# Altium schematic sheet ESP32.SchDoc
size A4; SheetNumber: 1; SheetTotal: 5
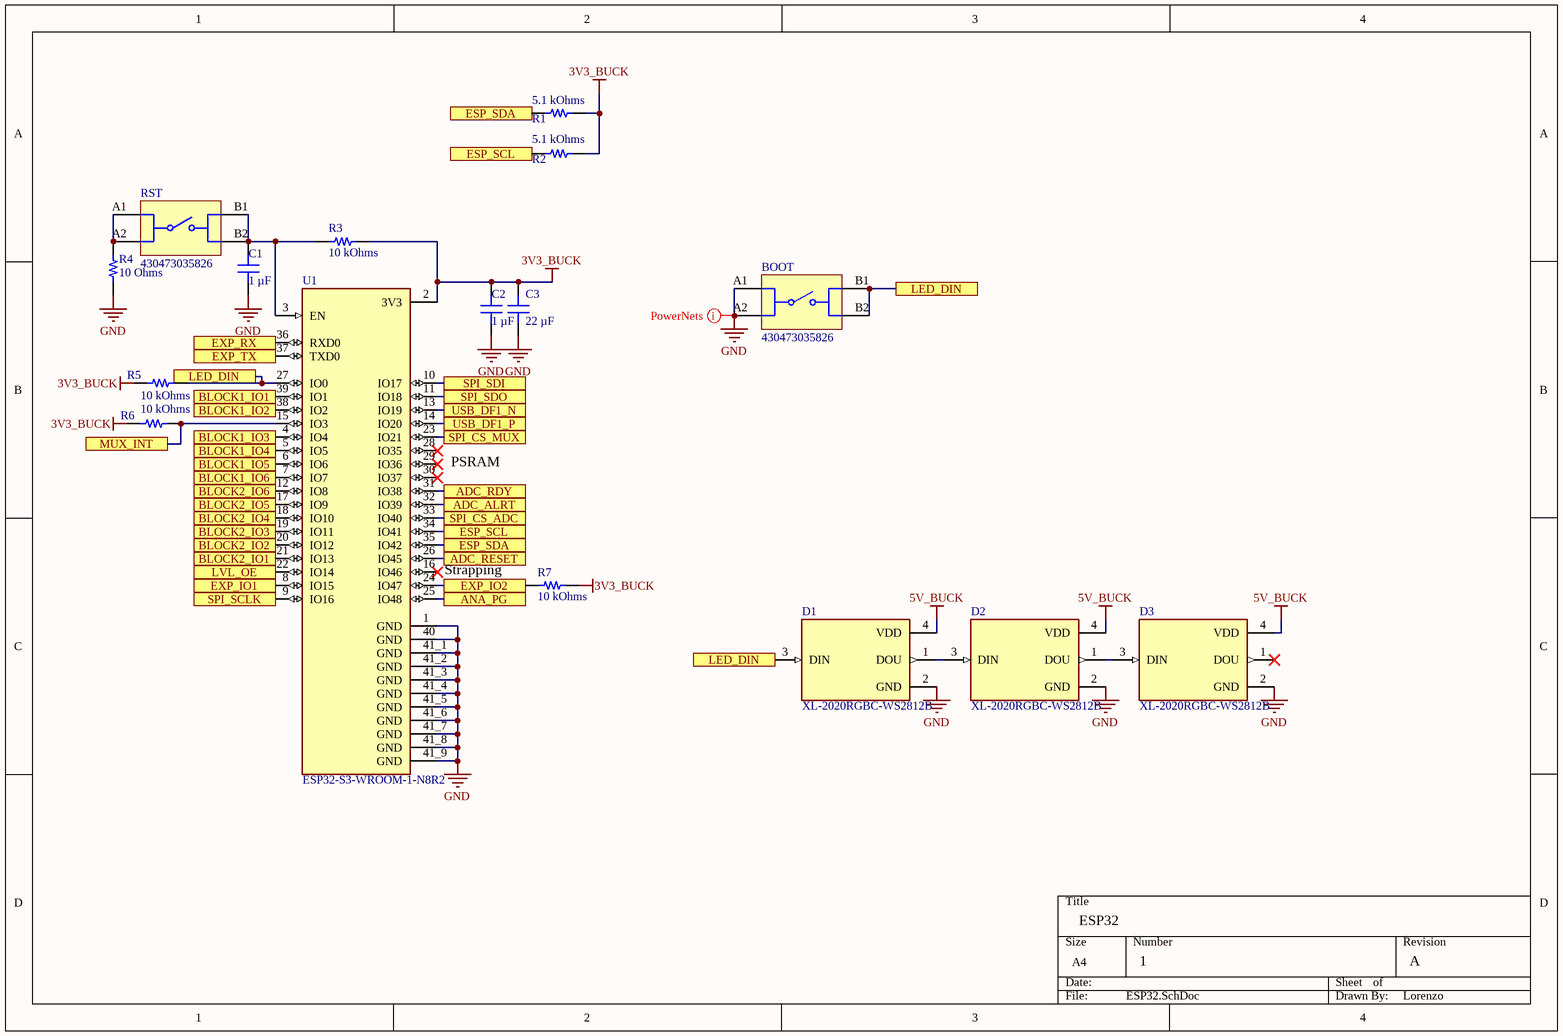
[diagram p0: ESP32.SchDoc]

## Parts
BOOT  430473035826  [430473035826]
C1  1 µF  [CAP 0603_1608]
C2  1 µF  [CAP 0603_1608]
C3  22 µF  [CAP 0603_1608]
D1  XL-2020RGBC-WS2812B  [LED_XL-2020RGBC-WS2812B]
D2  XL-2020RGBC-WS2812B  [LED_XL-2020RGBC-WS2812B]
D3  XL-2020RGBC-WS2812B  [LED_XL-2020RGBC-WS2812B]
R1  5.1 kOhms  [RES 0603_1608]
R2  5.1 kOhms  [RES 0603_1608]
R3  10 kOhms  [RES 0603_1608]
R4  10 Ohms  [RES 0603_1608]
R5  10 kOhms  [RES 0603_1608]
R6  10 kOhms  [RES 0603_1608]
R7  10 kOhms  [RES 0603_1608]
RST  430473035826  [430473035826]
U1  ESP32-S3-WROOM-1-N8R2  [XCVR_ESP32-S3-WROOM-1-N8R2]

## Ports
ADC_ALRT, ADC_RDY, ADC_RESET, ANA_PG, BLOCK1_IO1, BLOCK1_IO2, BLOCK1_IO3, BLOCK1_IO4, BLOCK1_IO5, BLOCK1_IO6, BLOCK2_IO1, BLOCK2_IO2, BLOCK2_IO3, BLOCK2_IO4, BLOCK2_IO5, BLOCK2_IO6, ESP_SCL, ESP_SDA, EXP_IO1, EXP_IO2, EXP_RX, EXP_TX, LED_DIN, LVL_OE, MUX_INT, SPI_CS_ADC, SPI_CS_MUX, SPI_SCLK, SPI_SDI, SPI_SDO, USB_DF1_N, USB_DF1_P

## Nets
3V3_BUCK: C2.2 C3.2 R1.2 R2.2 R3.2 R5.1 R6.1 R7.1 U1.2(3V3)
5V_BUCK: D1.4(VDD) D2.4(VDD) D3.4(VDD)
GND: BOOT.A1 BOOT.A2 C1.1 C2.1 C3.1 D1.2(GND) D2.2(GND) D3.2(GND) R4.1 U1.1(GND) U1.40(GND) U1.41_1(GND) U1.41_2(GND) U1.41_3(GND) U1.41_4(GND) U1.41_5(GND) U1.41_6(GND) U1.41_7(GND) U1.41_8(GND) U1.41_9(GND)
ADC_ALRT: U1.32(IO39) ; port ADC_ALRT
ADC_RDY: U1.31(IO38) ; port ADC_RDY
ADC_RESET: U1.26(IO45) ; port ADC_RESET
ANA_PG: U1.25(IO48) ; port ANA_PG
BLOCK1_IO1: U1.39(IO1) ; port BLOCK1_IO1
BLOCK1_IO2: U1.38(IO2) ; port BLOCK1_IO2
BLOCK1_IO3: U1.4(IO4) ; port BLOCK1_IO3
BLOCK1_IO4: U1.5(IO5) ; port BLOCK1_IO4
BLOCK1_IO5: U1.6(IO6) ; port BLOCK1_IO5
BLOCK1_IO6: U1.7(IO7) ; port BLOCK1_IO6
BLOCK2_IO1: U1.21(IO13) ; port BLOCK2_IO1
BLOCK2_IO2: U1.20(IO12) ; port BLOCK2_IO2
BLOCK2_IO3: U1.19(IO11) ; port BLOCK2_IO3
BLOCK2_IO4: U1.18(IO10) ; port BLOCK2_IO4
BLOCK2_IO5: U1.17(IO9) ; port BLOCK2_IO5
BLOCK2_IO6: U1.12(IO8) ; port BLOCK2_IO6
ESP_SCL: R2.1 U1.34(IO41) ; port ESP_SCL
ESP_SDA: R1.1 U1.35(IO42) ; port ESP_SDA
EXP_IO1: U1.8(IO15) ; port EXP_IO1
EXP_IO2: R7.2 U1.24(IO47) ; port EXP_IO2
EXP_RX: U1.36(RXD0) ; port EXP_RX
EXP_TX: U1.37(TXD0) ; port EXP_TX
LED_DIN: BOOT.B1 BOOT.B2 D1.3(DIN) R5.2 U1.27(IO0) ; port LED_DIN
LVL_OE: U1.22(IO14) ; port LVL_OE
MUX_INT: R6.2 U1.15(IO3) ; port MUX_INT
SPI_CS_ADC: U1.33(IO40) ; port SPI_CS_ADC
SPI_CS_MUX: U1.23(IO21) ; port SPI_CS_MUX
SPI_SCLK: U1.9(IO16) ; port SPI_SCLK
SPI_SDI: U1.10(IO17) ; port SPI_SDI
SPI_SDO: U1.11(IO18) ; port SPI_SDO
USB_DF1_N: U1.13(IO19) ; port USB_DF1_N
USB_DF1_P: U1.14(IO20) ; port USB_DF1_P
NetC1_2: C1.2 R3.1 RST.B1 RST.B2 U1.3(EN)
NetD1_1: D1.1(DOU) D2.3(DIN)
NetD2_1: D2.1(DOU) D3.3(DIN)
NetR4_2: R4.2 RST.A1 RST.A2

Not connected (* = marked no-connect by the designer): D3 1(DOU)*; U1 16(IO46)* 28(IO35)* 29(IO36)* 30(IO37)*

## Layout directives
net class PowerNets: GND

## Notes on the sheet
- (near U1) PSRAM
- Strapping
- ESP32
- 1
- A
- Lorenzo

## Library data of the parts
BOOT RST = CMP-1455-00006-5: Switch Tactile Spst-no 0.05A 12V; Actuator Material: Liquid Crystal Polymer, Polymer; Switch Travel: 250µm; Throw Configuration: SPST; Illumination Type: Non-Illuminated; Insulation Resistance: 100MΩ; Current Rating: 50mA; Switch Function: Off-Mom; Mechanical Life: 500kcycles; Min Operating Temperature: -40°C; Packaging: Tape and Reel; Max Operating Temperature: 85°C; Mount: Surface Mount; Contact Plating: Silver; RoHS: Compliant; Voltage Rating: 12V; Height: 3.5mm
C1 C2 = C1608X5R1H105K080AB: CAP CER 1UF 50V X5R 0603; manufacturer: TDK Corporation; Tolerance: ±10%; Part Number: C1608X5R1H105K080AB; Value: 1 µF; Applications: General Purpose; Capacitance: 1 µF; componentlink1description: Datasheet; componentlink1url: https://product.tdk.com/info/en/catalog/datasheets/mlcc_commercial_general_en.pdf?ref_disty=digikey; componentlink2description: DigiKey Link; componentlink2url: https://www.digikey.com/en/products/detail/tdk-corporation/C1608X5R1H105K080AB/2732903; Device Package: 0603 (1608 Metric); Features: Low ESL; lastupdated: 09/02/2024 20:10:02; Lifecycle Status: Active; Minimum Order: 1; Mounting Type: Surface Mount, MLCC; Operating Temperature: -55°C ~ 85°C; Package / Case: 0603 (1608 Metric); packaging: TapeAndReel; partid: 36337; Part Status: Active; price: 0.02; series: C; Size / Dimension: 0.063" L x 0.031" W (1.60mm x 0.80mm); Supplier 1: DigiKey; Supplier Part Number 1: 445-7468-1-ND; Temperature Coefficient: X5R; Thickness (Max): 0.035" (0.90mm); Voltage - Rated: 50V
C3 = CC0603MRX6S5BB226: CAP CER 22UF 6.3V X6S 0603; manufacturer: Yageo; Tolerance: ±20%; Part Number: CC0603MRX6S5BB226; Value: 22 µF; Applications: General Purpose; Capacitance: 22 µF; componentlink1description: Datasheet; componentlink1url: https://www.yageo.com/upload/media/product/productsearch/datasheet/mlcc/UPY-GPHC_X6S_4V-to-50V_5.pdf; componentlink2description: DigiKey Link; componentlink2url: https://www.digikey.com/en/products/detail/yageo/CC0603MRX6S5BB226/12698890; Device Package: 0603 (1608 Metric); lastupdated: 09/02/2024 20:09:49; Lifecycle Status: Active; Minimum Order: 1; Mounting Type: Surface Mount, MLCC; Operating Temperature: -55°C ~ 105°C; Package / Case: 0603 (1608 Metric); packaging: TapeAndReel; partid: 45941; Part Status: Active; price: 0.03; series: CC; Size / Dimension: 0.063" L x 0.031" W (1.60mm x 0.80mm); Supplier 1: DigiKey; Supplier Part Number 1: 13-CC0603MRX6S5BB226CT-ND; Temperature Coefficient: X6S; Thickness (Max): 0.039" (1.00mm); Voltage - Rated: 6.3V
D1-D3 = XL-2020RGBC-WS2812B: 2020 RGB LED(BUILT-IN IC); MF: XINGLIGHT; SnapEDA_Link: https://www.snapeda.com/parts/XL-2020RGBC-WS2812B/Xinglight/view-part/?ref=snap; Package: None; Value: *; MP: XL-2020RGBC-WS2812B; Check_prices: https://www.snapeda.com/parts/XL-2020RGBC-WS2812B/Xinglight/view-part/?ref=eda
R1 R2 = RMCF0603FT5K10: RES 5.1K OHM 1% 1/10W 0603; Manufacturer: Stackpole Electronics Inc; Power (Watts): 0.1W, 1/10W; Temperature Coefficient: ±100ppm/°C; Part Number: RMCF0603FT5K10; Value: 5.1 kOhms; ComponentLink1Description: Datasheet; ComponentLink1URL: https://www.seielect.com/catalog/sei-rmcf_rmcp.pdf; ComponentLink2Description: DigiKey Link; ComponentLink2URL: https://www.digikey.com/en/products/detail/stackpole-electronics-inc/RMCF0603FT5K10/1760908; Composition: Thick Film; Device Package: 0603 (1608 Metric); Features: Automotive AEC-Q200; Height - Seated (Max): 0.022" (0.55mm); LastUpdated: 09/02/2024 20:43:14; Lifecycle Status: Active; Minimum Order: 1; Number of Terminations: 2; Operating Temperature: -55°C ~ 155°C; Package / Case: 0603 (1608 Metric); Packaging: CutTape; PartId: 10617; Part Status: Active; Price: 0.01; Ratings: AEC-Q200; Resistance: 5.1 kOhms; Series: RMCF; Size / Dimension: 0.061" L x 0.031" W (1.55mm x 0.80mm); Supplier 1: DigiKey; Supplier Part Number 1: RMCF0603FT5K10CT-ND; Supplier Device Package: 0603; Tolerance: ±1%
R3 R5-R7 = SG73S1JTTD1002F: RES 10K OHM 1% 1/5W 0603; Manufacturer: KOA Speer Electronics, Inc.; Power (Watts): 0.2W, 1/5W; Temperature Coefficient: ±100ppm/°C; Part Number: SG73S1JTTD1002F; Value: 10 kOhms; ComponentLink1Description: Datasheet; ComponentLink1URL: http://www.koaspeer.com/catimages/Products/SG73S/SG73S.pdf; ComponentLink2Description: DigiKey Link; ComponentLink2URL: https://www.digikey.com/en/products/detail/koa-speer-electronics-inc/SG73S1JTTD1002F/10279969; Composition: Thick Film; Device Package: 0603 (1608 Metric); Features: Automotive AEC-Q200, Moisture Resistant, Pulse Withstanding; Height - Seated (Max): 0.022" (0.55mm); LastUpdated: 09/02/2024 20:43:35; Lifecycle Status: Active; Minimum Order: 1; Number of Terminations: 2; Operating Temperature: -55°C ~ 155°C; Package / Case: 0603 (1608 Metric); Packaging: TapeAndReel; PartId: 5386; Part Status: Active; Price: 0.01; Ratings: AEC-Q200; Resistance: 10 kOhms; Series: SG73S; Size / Dimension: 0.063" L x 0.031" W (1.60mm x 0.80mm); Supplier 1: DigiKey; Supplier Part Number 1: 2019-SG73S1JTTD1002FCT-ND; Supplier Device Package: 0603; Tolerance: ±1%
R4 = ESR03EZPF10R0: RES SMD 10 OHM 1% 1/4W 0603; Manufacturer: Rohm Semiconductor; Power (Watts): 0.25W, 1/4W; Temperature Coefficient: ±100ppm/°C; Part Number: ESR03EZPF10R0; Value: 10 Ohms; ComponentLink1Description: Datasheet; ComponentLink1URL: https://www.rohm.com/datasheet/ESR01MZPF/esr-e; ComponentLink2Description: DigiKey Link; ComponentLink2URL: https://www.digikey.com/en/products/detail/rohm-semiconductor/ESR03EZPF10R0/1983431; Composition: Thick Film; Device Package: 0603 (1608 Metric); Features: Automotive AEC-Q200, Pulse Withstanding; Height - Seated (Max): 0.022" (0.55mm); LastUpdated: 09/02/2024 20:43:34; Lifecycle Status: Active; Minimum Order: 1; Number of Terminations: 2; Operating Temperature: -55°C ~ 155°C; Package / Case: 0603 (1608 Metric); Packaging: TapeAndReel; PartId: 5471; Part Status: Active; Price: 0.02; Ratings: AEC-Q200; Resistance: 10 Ohms; Series: ESR; Size / Dimension: 0.063" L x 0.031" W (1.60mm x 0.80mm); Supplier 1: DigiKey; Supplier Part Number 1: RHM10.0ADCT-ND; Supplier Device Package: 0603; Tolerance: ±1%
U1 = ESP32-S3-WROOM-1-N8R2: WiFi 802.11a/b/g/n, Bluetooth v5.0 Transceiver Module 2.4GHz Antenna Not Included -; MF: Espressif Systems; Package: - Espressif Systems; Price: None; Check_prices: https://www.snapeda.com/parts/ESP32-S3-WROOM-1-N8R2/Espressif+Systems/view-part/?ref=eda; Value: *; SnapEDA_Link: https://www.snapeda.com/parts/ESP32-S3-WROOM-1-N8R2/Espressif+Systems/view-part/?ref=snap; MP: ESP32-S3-WROOM-1-N8R2; Availability: In Stock; Purchase-URL: https://pricing.snapeda.com/search?q=ESP32-S3-WROOM-1-N8R2&ref=eda